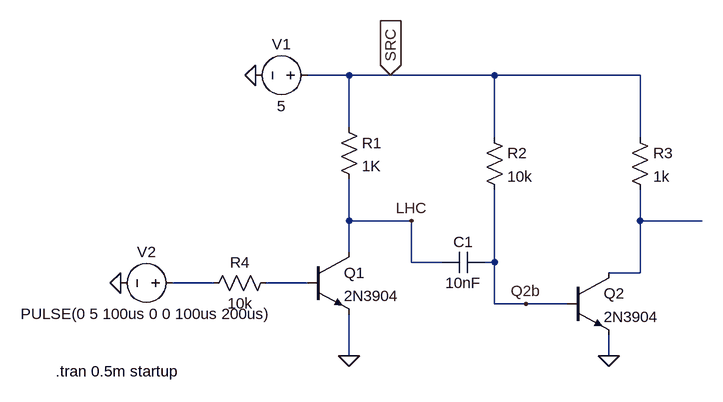
[diagram p0: schematic pulse_generator_I.asc]
pulse_generator_I.asc, the LTspice schematic file:
Version 4
SHEET 1 900 680
WIRE 272 176 208 176
WIRE 336 176 272 176
WIRE 496 176 336 176
WIRE 720 176 496 176
WIRE 272 256 272 176
WIRE 496 272 496 176
WIRE 720 272 720 176
WIRE 272 400 272 336
WIRE 368 400 272 400
WIRE 720 400 720 352
WIRE 816 400 720 400
WIRE 272 448 272 400
WIRE 368 464 368 400
WIRE 416 464 368 464
WIRE 496 464 496 352
WIRE 496 464 480 464
WIRE 720 480 720 400
WIRE 720 480 672 480
WIRE 64 496 0 496
WIRE 208 496 144 496
WIRE 496 528 496 464
WIRE 544 528 496 528
WIRE 608 528 544 528
WIRE 272 608 272 544
WIRE 672 608 672 576
FLAG 128 176 0
FLAG 272 608 0
FLAG 672 608 0
FLAG 544 528 Q2b
FLAG 368 400 LHC
FLAG 336 176 SRC
IOPIN 336 176 In
FLAG -80 496 0
SYMBOL voltage 224 176 R90
WINDOW 0 -32 56 VBottom 2
WINDOW 3 32 56 VTop 2
WINDOW 123 0 0 Left 0
WINDOW 39 0 0 Left 0
SYMATTR InstName V1
SYMATTR Value 5
SYMBOL res 256 240 R0
SYMATTR InstName R1
SYMATTR Value 1K
SYMATTR SpiceLine tol=1 pwr=0.1
SYMBOL res 480 256 R0
SYMATTR InstName R2
SYMATTR Value 10k
SYMBOL res 704 256 R0
SYMATTR InstName R3
SYMATTR Value 1k
SYMBOL res 160 480 R90
WINDOW 0 0 56 VBottom 2
WINDOW 3 32 56 VTop 2
SYMATTR InstName R4
SYMATTR Value 10k
SYMBOL npn 208 448 R0
SYMATTR InstName Q1
SYMATTR Value 2N3904
SYMBOL npn 608 480 R0
SYMATTR InstName Q2
SYMATTR Value 2N3904
SYMBOL cap 480 448 R90
WINDOW 0 0 32 VBottom 2
WINDOW 3 32 32 VTop 2
SYMATTR InstName C1
SYMATTR Value 10nF
SYMBOL voltage 16 496 R90
WINDOW 0 -32 56 VBottom 2
WINDOW 3 32 56 VTop 2
WINDOW 123 0 0 Left 0
WINDOW 39 0 0 Left 0
SYMATTR InstName V2
SYMATTR Value PULSE(0 5 100us 0 0 100us 200us)
TEXT -180 632 Left 2 !.tran 0.5m startup

The netlist it stands for:
* pulse_generator_I.asc
V1 SRC 0 5
R1 SRC LHC 1K tol=1 pwr=0.1
R2 SRC Q2b 10k
R3 SRC N001 1k
R4 N003 N002 10k
Q1 LHC N003 0 0 2N3904
Q2 N001 Q2b 0 0 2N3904
C1 Q2b LHC 10nF
V2 N002 0 PULSE(0 5 100us 0 0 100us 200us)
.model NPN NPN
.model PNP PNP
.lib standard.bjt
.tran 0.5m startup
.backanno
.end